# EAGLE schematic ROV_Main_Board (EAGLE 7.5.0)
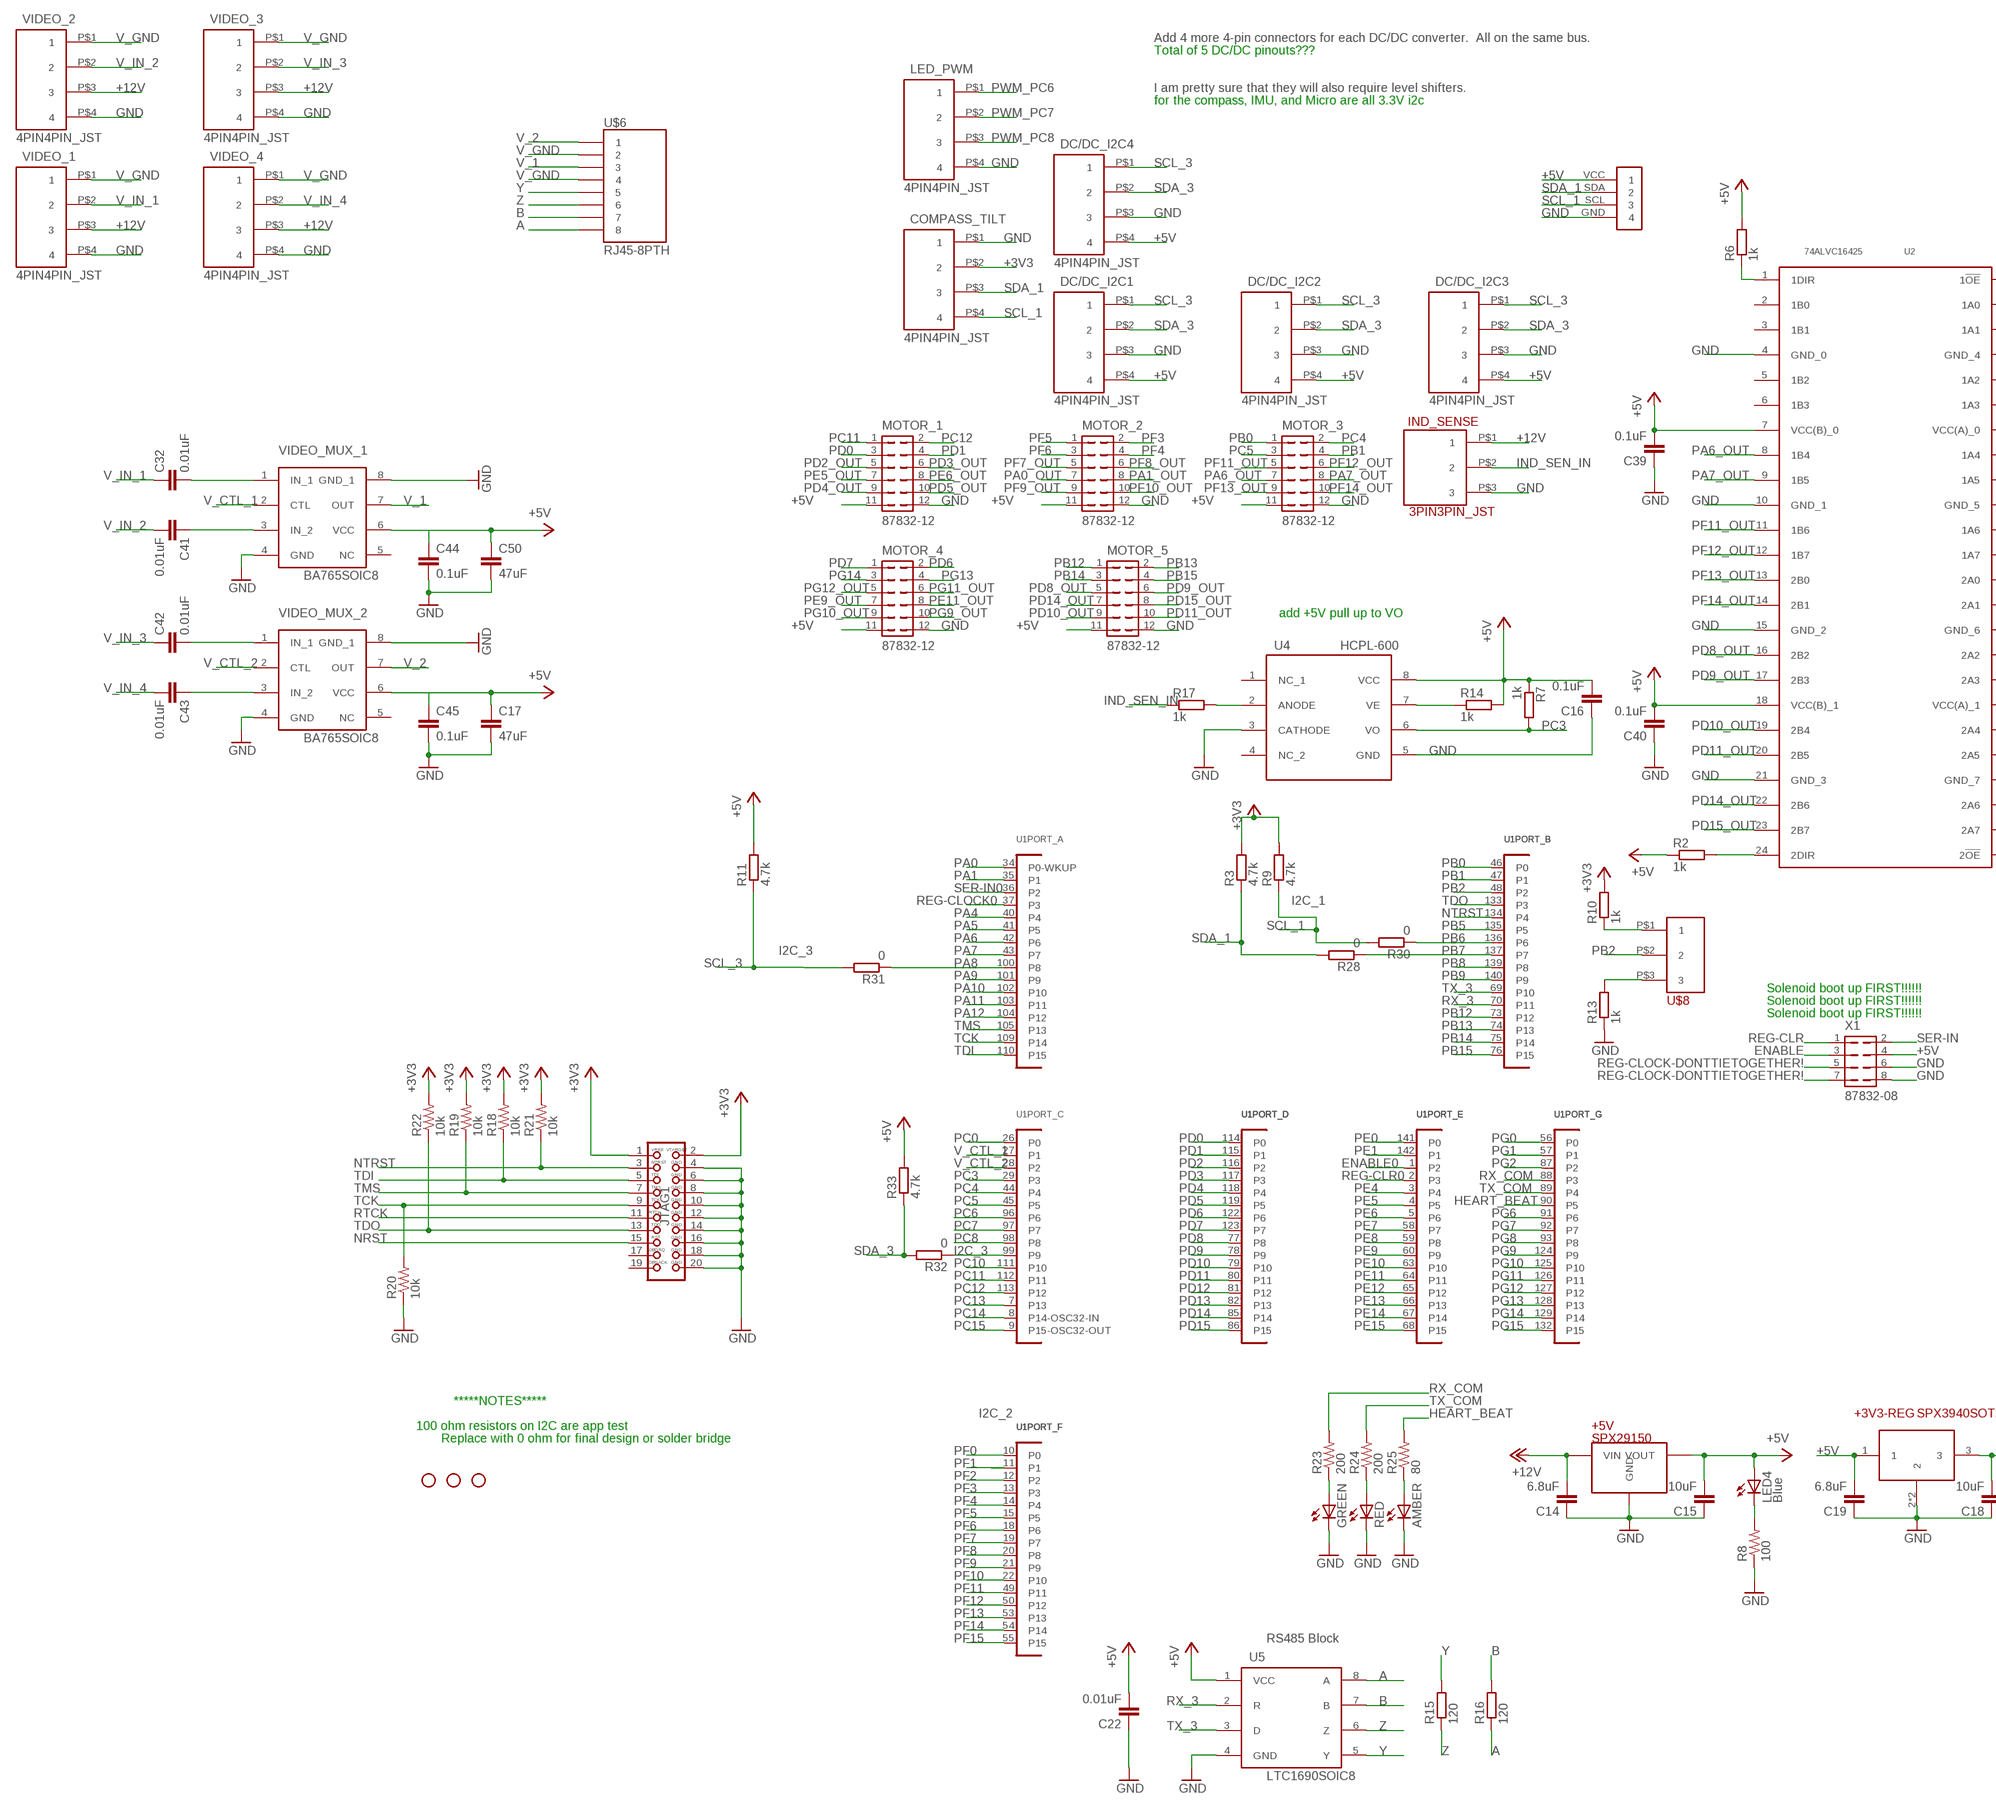
[diagram p0: schematic, sheet 1, part 1 of 2]
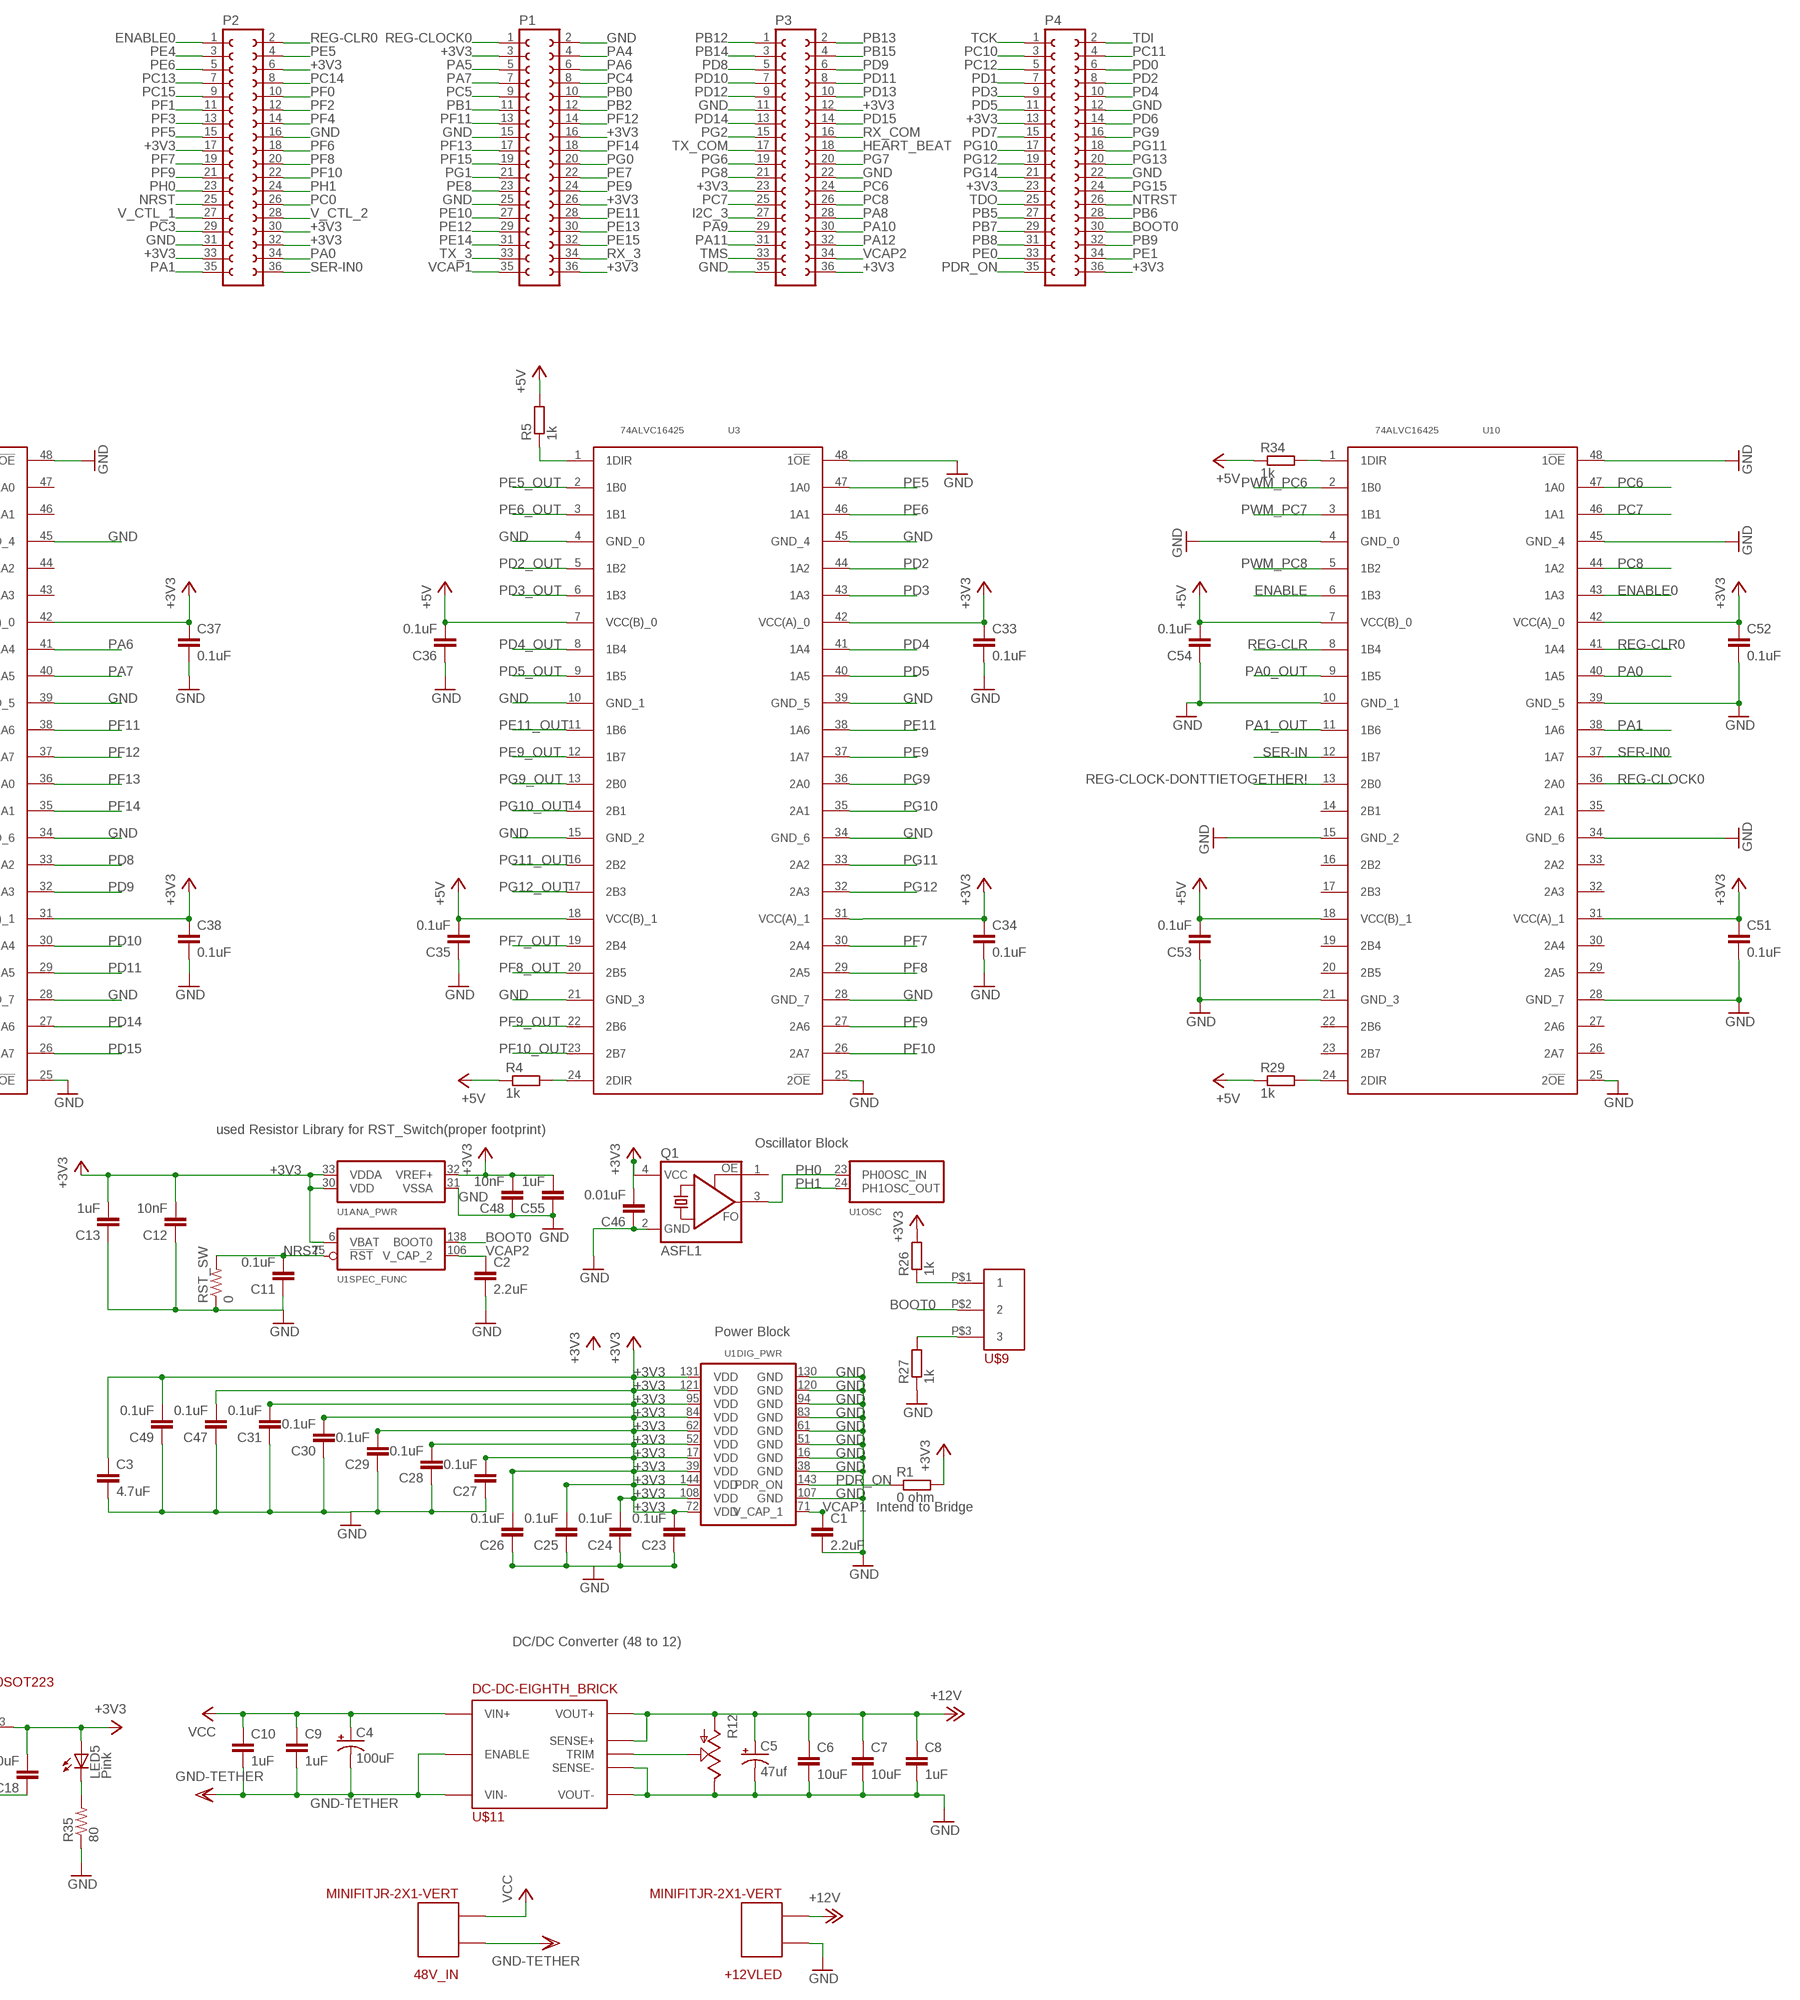
[diagram p1: schematic, sheet 1, part 2 of 2]

## Parts
48V_IN  MINIFITJR-2X1-VERT  [5566-02B]
+3V3-REG  SPX3940SOT223  [SOT223]
+5V  SPX29150  [DDPAK-3PIN]
+12VLED  MINIFITJR-2X1-VERT  [5566-02B]
AMBER  LED0603  [LED-0603]
C1  2.2uF  C-EUC0603  [C0603]
C2  2.2uF  C-EUC0603  [C0603]
C3  4.7uF  C-EUC0603  [C0603]
C4  100uF  CPOL-USE5-10.5  [E5-10,5]
C5  47uf  CPOL-USD  [PANASONIC_D]
C6  10uF  C-EUC0805  [C0805]
C7  10uF  C-EUC0805  [C0805]
C8  1uF  C-EUC0805  [C0805]
C9  1uF  C-EUC0805  [C0805]
C10  1uF  C-EUC0805  [C0805]
C11  0.1uF  C-EUC0603  [C0603]
C12  10nF  C-EUC0603  [C0603]
C13  1uF  C-EUC0603  [C0603]
C14  6.8uF  C-EUC0805  [C0805]
C15  10uF  C-EUC0805  [C0805]
C16  0.1uF  C-EUC0603  [C0603]
C17  47uF  C-EUC1206  [C1206]
C18  10uF  C-EUC0805  [C0805]
C19  6.8uF  C-EUC0805  [C0805]
C22  0.01uF  C-EUC0603  [C0603]
C23  0.1uF  C-EUC0603  [C0603]
C24  0.1uF  C-EUC0603  [C0603]
C25  0.1uF  C-EUC0603  [C0603]
C26  0.1uF  C-EUC0603  [C0603]
C27  0.1uF  C-EUC0603  [C0603]
C28  0.1uF  C-EUC0603  [C0603]
C29  0.1uF  C-EUC0603  [C0603]
C30  0.1uF  C-EUC0603  [C0603]
C31  0.1uF  C-EUC0603  [C0603]
C32  0.01uF  C-EUC0603  [C0603]
C33  0.1uF  C-EUC0603  [C0603]
C34  0.1uF  C-EUC0603  [C0603]
C35  0.1uF  C-EUC0603  [C0603]
C36  0.1uF  C-EUC0603  [C0603]
C37  0.1uF  C-EUC0603  [C0603]
C38  0.1uF  C-EUC0603  [C0603]
C39  0.1uF  C-EUC0603  [C0603]
C40  0.1uF  C-EUC0603  [C0603]
C41  0.01uF  C-EUC0603  [C0603]
C42  0.01uF  C-EUC0603  [C0603]
C43  0.01uF  C-EUC0603  [C0603]
C44  0.1uF  C-EUC0603  [C0603]
C45  0.1uF  C-EUC0603  [C0603]
C46  0.01uF  C-EUC0603  [C0603]
C47  0.1uF  C-EUC0603  [C0603]
C48  10nF  C-EUC0603  [C0603]
C49  0.1uF  C-EUC0603  [C0603]
C50  47uF  C-EUC1206  [C1206]
C51  0.1uF  C-EUC0603  [C0603]
C52  0.1uF  C-EUC0603  [C0603]
C53  0.1uF  C-EUC0603  [C0603]
C54  0.1uF  C-EUC0603  [C0603]
C55  1uF  C-EUC0603  [C0603]
COMPASS_TILT  4PIN4PIN_JST  [4PIN_JST]
DC/DC_I2C1  4PIN4PIN_JST  [4PIN_JST]
DC/DC_I2C2  4PIN4PIN_JST  [4PIN_JST]
DC/DC_I2C3  4PIN4PIN_JST  [4PIN_JST]
DC/DC_I2C4  4PIN4PIN_JST  [4PIN_JST]
GREEN  LED0603  [LED-0603]
IND_SENSE  3PIN3PIN_JST  [3PIN_JST]
JP1  STAND-OFF  [STAND-OFF]
JP2  STAND-OFF  [STAND-OFF]
JP3  STAND-OFF  [STAND-OFF]
JTAG1  JTAG-ARM  [JTAG-ARM]
LED4  Blue  LED0603  [LED-0603]
LED5  Pink  LED0603  [LED-0603]
LED_PWM  4PIN4PIN_JST  [4PIN_JST]
MOTOR_1  87832-12  [87832-12]
MOTOR_2  87832-12  [87832-12]
MOTOR_3  87832-12  [87832-12]
MOTOR_4  87832-12  [87832-12]
MOTOR_5  87832-12  [87832-12]
P1  FE18-2  [FE18-2]
P2  FE18-2  [FE18-2]
P3  FE18-2  [FE18-2]
P4  FE18-2  [FE18-2]
Q1  ASFL1  [ASF]
R1  0 ohm  R-EU_R0603  [R0603]
R2  1k  R-EU_R0603  [R0603]
R3  4.7k  R-EU_R0603  [R0603]
R4  1k  R-EU_R0603  [R0603]
R5  1k  R-EU_R0603  [R0603]
R6  1k  R-EU_R0603  [R0603]
R7  1k  R-EU_R0603  [R0603]
R8  100  RESISTOR0603-RES  [0603-RES]
R9  4.7k  R-EU_R0603  [R0603]
R10  1k  R-EU_R0603  [R0603]
R11  4.7k  R-EU_R0603  [R0603]
R12  TRIM_US-SM-42/43W  [SM-42/43W]
R13  1k  R-EU_R0603  [R0603]
R14  1k  R-EU_R0603  [R0603]
R15  120  R-EU_R0603  [R0603]
R16  120  R-EU_R0603  [R0603]
R17  1k  R-EU_R0603  [R0603]
R18  10k  R-US_R0603  [R0603]
R19  10k  R-US_R0603  [R0603]
R20  10k  R-US_R0603  [R0603]
R21  10k  R-US_R0603  [R0603]
R22  10k  R-US_R0603  [R0603]
R23  200  R-US_R0603  [R0603]
R24  200  R-US_R0603  [R0603]
R25  80  R-US_R0603  [R0603]
R26  1k  R-EU_R0603  [R0603]
R27  1k  R-EU_R0603  [R0603]
R28  0  R-EU_R0603  [R0603]
R29  1k  R-EU_R0603  [R0603]
R30  0  R-EU_R0603  [R0603]
R31  0  R-EU_R0603  [R0603]
R32  0  R-EU_R0603  [R0603]
R33  4.7k  R-EU_R0603  [R0603]
R34  1k  R-EU_R0603  [R0603]
R35  80  RESISTOR0603-RES  [0603-RES]
RED  LED0603  [LED-0603]
RST_SW  0  R-US_R2512  [R2512]
U1  STM32F103ZESTM32F407  [SQFP-S-20X20-144]
U2  74ALVC16425  [TSSOP48]
U3  74ALVC16425  [TSSOP48]
U4  HCPL-600  [SOIC8]
U5  LTC1690SOIC8  [SOIC8]
U10  74ALVC16425  [TSSOP48]
U$6  RJ45-8PTH  [RJ45-8]
U$7  9DOF-IMU-SFE  [9DOF-SFE]
U$8  1X3-SMD-1.27MM  [1X3-1.27-SMD]
U$9  1X3-SMD-1.27MM  [1X3-1.27-SMD]
U$11  DC-DC-EIGHTH_BRICK  [EIGHTH-BRICK]
VIDEO_1  4PIN4PIN_JST  [4PIN_JST]
VIDEO_2  4PIN4PIN_JST  [4PIN_JST]
VIDEO_3  4PIN4PIN_JST  [4PIN_JST]
VIDEO_4  4PIN4PIN_JST  [4PIN_JST]
VIDEO_MUX_1  BA765SOIC8  [SOIC8]
VIDEO_MUX_2  BA765SOIC8  [SOIC8]
X1  87832-08  [87832-08]

## Nets
+3V3: +3V3-REG.3 C3.1 C12.2 C13.2 C18.2 C23.2 C24.2 C25.2 C26.2 C27.2 C28.2 C29.2 C30.2 C31.2 C33.1 C34.1 C37.1 C38.1 C46.2 C47.2 C48.2 C49.2 C51.1 C52.1 C55.2 COMPASS_TILT.P$2 JTAG1.1 JTAG1.2 LED5.A P1.3 P1.16 P1.26 P1.36 P2.6 P2.17 P2.30 P2.32 P2.33 P3.12 P3.23 P3.36 P4.13 P4.23 P4.36 Q1.4(VCC) R1.2 R3.2 R9.2 R10.2 R18.2 R19.2 R21.2 R22.2 R26.2 U1.6(SPEC_FUNC:VBAT) U1.17(DIG_PWR:VDD) U1.30(ANA_PWR:VDD) U1.32(ANA_PWR:VREF+) U1.33(ANA_PWR:VDDA) U1.39(DIG_PWR:VDD) U1.52(DIG_PWR:VDD) U1.62(DIG_PWR:VDD) U1.72(DIG_PWR:VDD) U1.84(DIG_PWR:VDD) U1.95(DIG_PWR:VDD) U1.108(DIG_PWR:VDD) U1.121(DIG_PWR:VDD) U1.131(DIG_PWR:VDD) U1.144(DIG_PWR:VDD) U2.31(VCC(A)_1) U2.42(VCC(A)_0) U3.31(VCC(A)_1) U3.42(VCC(A)_0) U10.31(VCC(A)_1) U10.42(VCC(A)_0)
+5V: +3V3-REG.1 +5V.P$3(VOUT) C15.2 C16.2 C17.1 C19.2 C22.2 C35.2 C36.2 C39.2 C40.2 C44.1 C45.1 C50.1 C53.2 C54.2 DC/DC_I2C1.P$4 DC/DC_I2C2.P$4 DC/DC_I2C3.P$4 DC/DC_I2C4.P$4 LED4.A MOTOR_1.11 MOTOR_2.11 MOTOR_3.11 MOTOR_4.11 MOTOR_5.11 R2.1 R4.1 R5.2 R6.2 R7.1 R11.2 R14.2 R29.1 R33.2 R34.1 U2.7(VCC(B)_0) U2.18(VCC(B)_1) U3.7(VCC(B)_0) U3.18(VCC(B)_1) U4.8(VCC) U5.1(VCC) U10.7(VCC(B)_0) U10.18(VCC(B)_1) U$7.VCC VIDEO_MUX_1.6(VCC) VIDEO_MUX_2.6(VCC) X1.4
+12V: +5V.P$1(VIN) +12VLED.P$2 C5.+ C6.1 C7.1 C8.1 C14.2 IND_SENSE.P$1 R12.1(A) U$11.SENSE(+)(SENSE+) U$11.VOUT(+)(VOUT+) VIDEO_1.P$3 VIDEO_2.P$3 VIDEO_3.P$3 VIDEO_4.P$3
A: R16.1 U5.8(A) U$6.8
B: R16.2 U5.7(B) U$6.7
BOOT0: P4.30 U1.138(SPEC_FUNC:BOOT0) U$9.P$2
ENABLE: U10.6(1B3) X1.3
ENABLE0: P2.1 U1.1(PORT_E:P2) U10.43(1A3)
GND: +3V3-REG.2 +3V3-REG.4 +5V.P$2(GND) +5V.P$4(GND) +12VLED.P$1 AMBER.C C1.2 C2.2 C3.2 C5.- C6.2 C7.2 C8.2 C11.1 C12.1 C13.1 C14.1 C15.1 C16.1 C17.2 C18.1 C19.1 C22.1 C23.1 C24.1 C25.1 C26.1 C27.1 C28.1 C29.1 C30.1 C31.1 C33.2 C34.2 C35.1 C36.1 C37.2 C38.2 C39.1 C40.1 C44.2 C45.2 C46.1 C47.1 C48.1 C49.1 C50.2 C51.2 C52.2 C53.1 C54.1 C55.1 COMPASS_TILT.P$1 DC/DC_I2C1.P$3 DC/DC_I2C2.P$3 DC/DC_I2C3.P$3 DC/DC_I2C4.P$3 GREEN.C IND_SENSE.P$3 JTAG1.4 JTAG1.6 JTAG1.8 JTAG1.10 JTAG1.12 JTAG1.14 JTAG1.16 JTAG1.18 JTAG1.20 LED_PWM.P$4 MOTOR_1.12 MOTOR_2.12 MOTOR_3.12 MOTOR_4.12 MOTOR_5.12 P1.2 P1.15 P1.25 P2.16 P2.31 P3.11 P3.22 P3.35 P4.12 P4.22 Q1.2(GND) R8.1 R12.3(E) R13.1 R20.1 R27.1 R35.1 RED.C RST_SW.1 U1.16(DIG_PWR:GND) U1.31(ANA_PWR:VSSA) U1.38(DIG_PWR:GND) U1.51(DIG_PWR:GND) U1.61(DIG_PWR:GND) U1.83(DIG_PWR:GND) U1.94(DIG_PWR:GND) U1.107(DIG_PWR:GND) U1.120(DIG_PWR:GND) U1.130(DIG_PWR:GND) U2.4(GND_0) U2.10(GND_1) U2.15(GND_2) U2.21(GND_3) U2.25(2!OE) U2.28(GND_7) U2.34(GND_6) U2.39(GND_5) U2.45(GND_4) U2.48(1!OE) U3.4(GND_0) U3.10(GND_1) U3.15(GND_2) U3.21(GND_3) U3.25(2!OE) U3.28(GND_7) U3.34(GND_6) U3.39(GND_5) U3.45(GND_4) U3.48(1!OE) U4.3(CATHODE) U4.5(GND) U5.4(GND) U10.4(GND_0) U10.10(GND_1) U10.15(GND_2) U10.21(GND_3) U10.25(2!OE) U10.28(GND_7) U10.34(GND_6) U10.39(GND_5) U10.45(GND_4) U10.48(1!OE) U$7.GND U$11.SENSE(-)(SENSE-) U$11.VOUT(-)(VOUT-) VIDEO_1.P$4 VIDEO_2.P$4 VIDEO_3.P$4 VIDEO_4.P$4 VIDEO_MUX_1.4(GND) VIDEO_MUX_1.8(GND_1) VIDEO_MUX_2.4(GND) VIDEO_MUX_2.8(GND_1) X1.6 X1.8
GND-TETHER: 48V_IN.P$1 C4.- C9.2 C10.2 U$11.ENABLE U$11.VIN(-)(VIN-)
HEART_BEAT: P3.18 R25.2 U1.90(PORT_G:P5)
I2C_3: P3.27 R32.1 U1.99(PORT_C:P9)
IND_SEN_IN: IND_SENSE.P$2 R17.1
N$1: R12.2(S) U$11.TRIM
N$2: LED4.C R8.2
N$3: R26.1 U$9.P$1
N$4: LED5.C R35.2
N$8: R14.1 U4.7(VE)
N$10: R17.2 U4.2(ANODE)
N$12: GREEN.A R23.1
N$13: R24.1 RED.A
N$14: C32.2 VIDEO_MUX_1.1(IN_1)
N$15: AMBER.A R25.1
N$19: C41.1 VIDEO_MUX_1.3(IN_2)
N$20: C42.2 VIDEO_MUX_2.1(IN_1)
N$21: C43.1 VIDEO_MUX_2.3(IN_2)
N$24: R29.2 U10.24(2DIR)
N$25: R27.2 U$9.P$3
N$26: R6.1 U2.1(1DIR)
N$27: R5.1 U3.1(1DIR)
N$28: R4.2 U3.24(2DIR)
N$29: R2.2 U2.24(2DIR)
N$30: R10.1 U$8.P$1
N$31: R13.2 U$8.P$3
N$32: R34.2 U10.1(1DIR)
NRST: C11.2 JTAG1.15 P2.25 RST_SW.2 U1.25(SPEC_FUNC:!RST)
NTRST: JTAG1.3 P4.26 R21.1 U1.134(PORT_B:P4)
PA0: P2.34 U1.34(PORT_A:P0-WKUP) U10.40(1A5)
PA0_OUT: MOTOR_2.7 U10.9(1B5)
PA1: P2.35 U1.35(PORT_A:P1) U10.38(1A6)
PA1_OUT: MOTOR_2.8 U10.11(1B6)
PA4: P1.4 U1.40(PORT_A:P4)
PA5: P1.5 U1.41(PORT_A:P5)
PA6: P1.6 U1.42(PORT_A:P6) U2.41(1A4)
PA6_OUT: MOTOR_3.7 U2.8(1B4)
PA7: P1.7 U1.43(PORT_A:P7) U2.40(1A5)
PA7_OUT: MOTOR_3.8 U2.9(1B5)
PA8: P3.28 R31.1 U1.100(PORT_A:P8)
PA9: P3.29 U1.101(PORT_A:P9)
PA10: P3.30 U1.102(PORT_A:P10)
PA11: P3.31 U1.103(PORT_A:P11)
PA12: P3.32 U1.104(PORT_A:P12)
PB0: MOTOR_3.1 P1.10 U1.46(PORT_B:P0)
PB1: MOTOR_3.4 P1.11 U1.47(PORT_B:P1)
PB2: P1.12 U1.48(PORT_B:P2) U$8.P$2
PB5: P4.27 U1.135(PORT_B:P5)
PB6: P4.28 R30.1 U1.136(PORT_B:P6)
PB7: P4.29 R28.1 U1.137(PORT_B:P7)
PB8: P4.31 U1.139(PORT_B:P8)
PB9: P4.32 U1.140(PORT_B:P9)
PB12: MOTOR_5.1 P3.1 U1.73(PORT_B:P12)
PB13: MOTOR_5.2 P3.2 U1.74(PORT_B:P13)
PB14: MOTOR_5.3 P3.3 U1.75(PORT_B:P14)
PB15: MOTOR_5.4 P3.4 U1.76(PORT_B:P15)
PC0: P2.26 U1.26(PORT_C:P0)
PC3: P2.29 R7.2 U1.29(PORT_C:P3) U4.6(VO)
PC4: MOTOR_3.2 P1.8 U1.44(PORT_C:P4)
PC5: MOTOR_3.3 P1.9 U1.45(PORT_C:P5)
PC6: P3.24 U1.96(PORT_C:P6) U10.47(1A0)
PC7: P3.25 U1.97(PORT_C:P7) U10.46(1A1)
PC8: P3.26 U1.98(PORT_C:P8) U10.44(1A2)
PC10: P4.3 U1.111(PORT_C:P10)
PC11: MOTOR_1.1 P4.4 U1.112(PORT_C:P11)
PC12: MOTOR_1.2 P4.5 U1.113(PORT_C:P12)
PC13: P2.7 U1.7(PORT_C:P13)
PC14: P2.8 U1.8(PORT_C:P14-OSC32-IN)
PC15: P2.9 U1.9(PORT_C:P15-OSC32-OUT)
PD0: MOTOR_1.3 P4.6 U1.114(PORT_D:P0)
PD1: MOTOR_1.4 P4.7 U1.115(PORT_D:P1)
PD2: P4.8 U1.116(PORT_D:P2) U3.44(1A2)
PD2_OUT: MOTOR_1.5 U3.5(1B2)
PD3: P4.9 U1.117(PORT_D:P3) U3.43(1A3)
PD3_OUT: MOTOR_1.6 U3.6(1B3)
PD4: P4.10 U1.118(PORT_D:P4) U3.41(1A4)
PD4_OUT: MOTOR_1.9 U3.8(1B4)
PD5: P4.11 U1.119(PORT_D:P5) U3.40(1A5)
PD5_OUT: MOTOR_1.10 U3.9(1B5)
PD6: MOTOR_4.2 P4.14 U1.122(PORT_D:P6)
PD7: MOTOR_4.1 P4.15 U1.123(PORT_D:P7)
PD8: P3.5 U1.77(PORT_D:P8) U2.33(2A2)
PD8_OUT: MOTOR_5.5 U2.16(2B2)
PD9: P3.6 U1.78(PORT_D:P9) U2.32(2A3)
PD9_OUT: MOTOR_5.6 U2.17(2B3)
PD10: P3.7 U1.79(PORT_D:P10) U2.30(2A4)
PD10_OUT: MOTOR_5.9 U2.19(2B4)
PD11: P3.8 U1.80(PORT_D:P11) U2.29(2A5)
PD11_OUT: MOTOR_5.10 U2.20(2B5)
PD12: P3.9 U1.81(PORT_D:P12)
PD13: P3.10 U1.82(PORT_D:P13)
PD14: P3.13 U1.85(PORT_D:P14) U2.27(2A6)
PD14_OUT: MOTOR_5.7 U2.22(2B6)
PD15: P3.14 U1.86(PORT_D:P15) U2.26(2A7)
PD15_OUT: MOTOR_5.8 U2.23(2B7)
PDR_ON: P4.35 R1.1 U1.143(DIG_PWR:PDR_ON)
PE0: P4.33 U1.141(PORT_E:P0)
PE1: P4.34 U1.142(PORT_E:P1)
PE4: P2.3 U1.3(PORT_E:P4)
PE5: P2.4 U1.4(PORT_E:P5) U3.47(1A0)
PE5_OUT: MOTOR_1.7 U3.2(1B0)
PE6: P2.5 U1.5(PORT_E:P6) U3.46(1A1)
PE6_OUT: MOTOR_1.8 U3.3(1B1)
PE7: P1.22 U1.58(PORT_E:P7)
PE8: P1.23 U1.59(PORT_E:P8)
PE9: P1.24 U1.60(PORT_E:P9) U3.37(1A7)
PE9_OUT: MOTOR_4.7 U3.12(1B7)
PE10: P1.27 U1.63(PORT_E:P10)
PE11: P1.28 U1.64(PORT_E:P11) U3.38(1A6)
PE11_OUT: MOTOR_4.8 U3.11(1B6)
PE12: P1.29 U1.65(PORT_E:P12)
PE13: P1.30 U1.66(PORT_E:P13)
PE14: P1.31 U1.67(PORT_E:P14)
PE15: P1.32 U1.68(PORT_E:P15)
PF0: P2.10 U1.10(PORT_F:P0)
PF1: P2.11 U1.11(PORT_F:P1)
PF2: P2.12 U1.12(PORT_F:P2)
PF3: MOTOR_2.2 P2.13 U1.13(PORT_F:P3)
PF4: MOTOR_2.4 P2.14 U1.14(PORT_F:P4)
PF5: MOTOR_2.1 P2.15 U1.15(PORT_F:P5)
PF6: MOTOR_2.3 P2.18 U1.18(PORT_F:P6)
PF7: P2.19 U1.19(PORT_F:P7) U3.30(2A4)
PF7_OUT: MOTOR_2.5 U3.19(2B4)
PF8: P2.20 U1.20(PORT_F:P8) U3.29(2A5)
PF8_OUT: MOTOR_2.6 U3.20(2B5)
PF9: P2.21 U1.21(PORT_F:P9) U3.27(2A6)
PF9_OUT: MOTOR_2.9 U3.22(2B6)
PF10: P2.22 U1.22(PORT_F:P10) U3.26(2A7)
PF10_OUT: MOTOR_2.10 U3.23(2B7)
PF11: P1.13 U1.49(PORT_F:P11) U2.38(1A6)
PF11_OUT: MOTOR_3.5 U2.11(1B6)
PF12: P1.14 U1.50(PORT_F:P12) U2.37(1A7)
PF12_OUT: MOTOR_3.6 U2.12(1B7)
PF13: P1.17 U1.53(PORT_F:P13) U2.36(2A0)
PF13_OUT: MOTOR_3.9 U2.13(2B0)
PF14: P1.18 U1.54(PORT_F:P14) U2.35(2A1)
PF14_OUT: MOTOR_3.10 U2.14(2B1)
PF15: P1.19 U1.55(PORT_F:P15)
PG0: P1.20 U1.56(PORT_G:P0)
PG1: P1.21 U1.57(PORT_G:P1)
PG2: P3.15 U1.87(PORT_G:P2)
PG6: P3.19 U1.91(PORT_G:P6)
PG7: P3.20 U1.92(PORT_G:P7)
PG8: P3.21 U1.93(PORT_G:P8)
PG9: P4.16 U1.124(PORT_G:P9) U3.36(2A0)
PG9_OUT: MOTOR_4.10 U3.13(2B0)
PG10: P4.17 U1.125(PORT_G:P10) U3.35(2A1)
PG10_OUT: MOTOR_4.9 U3.14(2B1)
PG11: P4.18 U1.126(PORT_G:P11) U3.33(2A2)
PG11_OUT: MOTOR_4.6 U3.16(2B2)
PG12: P4.19 U1.127(PORT_G:P12) U3.32(2A3)
PG12_OUT: MOTOR_4.5 U3.17(2B3)
PG13: MOTOR_4.4 P4.20 U1.128(PORT_G:P13)
PG14: MOTOR_4.3 P4.21 U1.129(PORT_G:P14)
PG15: P4.24 U1.132(PORT_G:P15)
PH0: P2.23 Q1.3(FO) U1.23(OSC:PH0OSC_IN)
PH1: P2.24 U1.24(OSC:PH1OSC_OUT)
PWM_PC6: LED_PWM.P$1 U10.2(1B0)
PWM_PC7: LED_PWM.P$2 U10.3(1B1)
PWM_PC8: LED_PWM.P$3 U10.5(1B2)
REG-CLOCK0: P1.1 U1.37(PORT_A:P3) U10.36(2A0)
REG-CLOCK-DONTTIETOGETHER!: U10.13(2B0) X1.5 X1.7
REG-CLR: U10.8(1B4) X1.1
REG-CLR0: P2.2 U1.2(PORT_E:P3) U10.41(1A4)
RTCK: JTAG1.11
RX_3: P1.34 U1.70(PORT_B:P11) U5.2(R)
RX_COM: P3.16 R23.2 U1.88(PORT_G:P3)
SCL_1: COMPASS_TILT.P$4 R9.1 R30.2 U$7.SCL
SCL_3: DC/DC_I2C1.P$1 DC/DC_I2C2.P$1 DC/DC_I2C3.P$1 DC/DC_I2C4.P$1 R11.1 R31.2
SDA_1: COMPASS_TILT.P$3 R3.1 R28.2 U$7.SDA
SDA_3: DC/DC_I2C1.P$2 DC/DC_I2C2.P$2 DC/DC_I2C3.P$2 DC/DC_I2C4.P$2 R32.2 R33.1
SER-IN: U10.12(1B7) X1.2
SER-IN0: P2.36 U1.36(PORT_A:P2) U10.37(1A7)
TCK: JTAG1.9 P4.1 R20.2 U1.109(PORT_A:P14)
TDI: JTAG1.5 P4.2 R18.1 U1.110(PORT_A:P15)
TDO: JTAG1.13 P4.25 R22.1 U1.133(PORT_B:P3)
TMS: JTAG1.7 P3.33 R19.1 U1.105(PORT_A:P13)
TX_3: P1.33 U1.69(PORT_B:P10) U5.3(D)
TX_COM: P3.17 R24.2 U1.89(PORT_G:P4)
V_1: U$6.3 VIDEO_MUX_1.7(OUT)
V_2: U$6.1 VIDEO_MUX_2.7(OUT)
V_CTL_1: P2.27 U1.27(PORT_C:P1) VIDEO_MUX_1.2(CTL)
V_CTL_2: P2.28 U1.28(PORT_C:P2) VIDEO_MUX_2.2(CTL)
V_GND: U$6.2 U$6.4 VIDEO_1.P$1 VIDEO_2.P$1 VIDEO_3.P$1 VIDEO_4.P$1
V_IN_1: C32.1 VIDEO_1.P$2
V_IN_2: C41.2 VIDEO_2.P$2
V_IN_3: C42.1 VIDEO_3.P$2
V_IN_4: C43.2 VIDEO_4.P$2
VCAP1: C1.1 P1.35 U1.71(DIG_PWR:V_CAP_1)
VCAP2: C2.1 P3.34 U1.106(SPEC_FUNC:V_CAP_2)
VCC: 48V_IN.P$2 C4.+ C9.1 C10.1 U$11.VIN(+)(VIN+)
Y: R15.2 U5.5(Y) U$6.5
Z: R15.1 U5.6(Z) U$6.6
Unconnected: JTAG1.17 JTAG1.19 Q1.1(OE) U2.2(1B0) U2.3(1B1) U2.5(1B2) U2.6(1B3) U2.43(1A3) U2.44(1A2) U2.46(1A1) U2.47(1A0) U4.1(NC_1) U4.4(NC_2) U10.14(2B1) U10.16(2B2) U10.17(2B3) U10.19(2B4) U10.20(2B5) U10.22(2B6) U10.23(2B7) U10.26(2A7) U10.27(2A6) U10.29(2A5) U10.30(2A4) U10.32(2A3) U10.33(2A2) U10.35(2A1) VIDEO_MUX_1.5(NC) VIDEO_MUX_2.5(NC)

## Notes on the sheet
- Add 4 more 4-pin connectors for each DC/DC converter.  All on the same bus.
- Total of 5 DC/DC pinouts???
- I am pretty sure that they will also require level shifters.
- for the compass, IMU, and Micro are all 3.3V i2c
- add +5V pull up to VO
- I2C_1 | used Resistor Library for RST_Switch(proper footprint)
- Oscillator Block
- I2C_3
- Solenoid boot up FIRST!!!!!!
- Solenoid boot up FIRST!!!!!!
- Solenoid boot up FIRST!!!!!!
- Power Block
- Intend to Bridge
- DC/DC Converter (48 to 12)
- *****NOTES*****
- I2C_2
- 100 ohm resistors on I2C are app test
- Replace with 0 ohm for final design or solder bridge
- RS485 Block

## Library data of the parts
48V_IN +12VLED = Personal:MINIFITJR-2X1-VERT
+3V3-REG = spx3940:SPX3940
+5V = Personal:SPX29150
AMBER GREEN RED = SparkFun:LED: LEDs Standard schematic elements and footprints for 5mm, 3mm, 1206, and 0603 sized LEDs. 5mm - Spark Fun Electronics SKU : COM-00529 (and others)
C1 C2 = resistor:C-EU: CAPACITOR, European symbol; BOM: INCLUDE; PARTNO: 587-1263-1-ND
C3 = resistor:C-EU: CAPACITOR, European symbol; BOM: INCLUDE; PARTNO: 587-2786-1-ND
C4 = resistor:CPOL-US: POLARIZED CAPACITOR, American symbol; BOM: INCLUDE; PARTNO: 493-1668-ND
C5 = resistor:CPOL-US: POLARIZED CAPACITOR, American symbol; BOM: INCLUDE; PARTNO: PCE3929CT-ND
C6 C7 C15 C18 = resistor:C-EU: CAPACITOR, European symbol; BOM: INCLUDE; PARTNO: 587-2985-1-ND
C8-C10 C13 C55 = resistor:C-EU: CAPACITOR, European symbol; BOM: INCLUDE; PARTNO: 445-5205-1-ND
C11 C16 C23-C31 C33-C40 C44 C45 C47 C49 C51-C54 = resistor:C-EU: CAPACITOR, European symbol; BOM: INCLUDE; PARTNO: 311-1344-1-ND
C12 C22 C32 C41-C43 C46 C48 = resistor:C-EU: CAPACITOR, European symbol; BOM: INCLUDE; PARTNO: 478-1227-1-ND
C14 C19 = resistor:C-EU: CAPACITOR, European symbol; BOM: INCLUDE; PARTNO: 445-5982-1-ND
C17 C50 = resistor:C-EU: CAPACITOR, European symbol; BOM: INCLUDE; PARTNO: 490-5528-1-ND
COMPASS_TILT DC/DC_I2C1-DC/DC_I2C4 LED_PWM = 4pin:4PIN; BOM: INCLUDE; PARTNO: 455-1659-ND
IND_SENSE = 3pin:3PIN; BOM: INCLUDE; PARTNO: 455-1658-ND
JP1-JP3 = SparkFun:STAND-OFF: Stand Off This is the mechanical footprint for a #4 phillips button head screw. Use the keepout ring to avoid running the screw head into surrounding components. SKU : PRT-00447
JTAG1 = microbuilder:JTAG-ARM: 20 Pin JTAG Connector For use with ARM7, and ARM9. Supported by some Cortex M3 boards with SWJ-DP interfaces (dual SWP/JTAG support). 4UConnector: 03556; BOM: INCLUDE; PARTNO: S9172-ND
LED4 LED5 = SparkFun-LED:LED: LEDs Standard schematic elements and footprints for 5mm, 3mm, 1206, and 0603 sized LEDs. 5mm - Spark Fun Electronics SKU : COM-00529 (and others)
MOTOR_1-MOTOR_5 = con-molex:87832-12: Milli-Grid Header 2.00mm (.079") Pitch; BOM: INCLUDE; OC_FARNELL: 1756948; OC_NEWARK: unknown; PARTNO: WM18640-ND
P1-P4 = Personal:FE18-2: FEMALE HEADER; OC_FARNELL: unknown; OC_NEWARK: unknown
Q1 = crystal:ASF*: CRYSTAL CLOCK OSCILLATORS 5.0 Vdc or 3.3 Vdc - LOW PROFILE ULTRA MINIATURE CERAMIC SURFACE MOUNT Source: http://www.abracon.com/Oscillators/asf1-L-L1.pdf; MF: Abracon Corporation; MPN: ASFL1-125.000MHZ-EC-T; OC_FARNELL: 1838931; OC_NEWARK: 19M1882
R1-R7 R9-R11 R13-R17 R26-R34 = resistor:R-EU_: RESISTOR, European symbol
R8 R35 = SparkFun-Passives:RESISTOR: Resistor Basic schematic elements and footprints for 0603, 1206, and PTH resistors.
R12 = pot:TRIM_US-: POTENTIOMETER
R18-R25 RST_SW = resistor:R-US_: RESISTOR, American symbol
U1 = stm32_lqfp144:STM32F103ZE: 72 MHz, 64KB RAM, 512 KB Flash
U2 U3 U10 = 74alvc164245:74ALVC16425: Bidirectional level shifter/translator
U4 = hcpl-0600:HCPL-600
U5 = ltc1690:LTC1690: RS485 transciever
U$6 = SparkFun-Connectors:RJ45-8: RJ45 Jack Simple RJ45, 8-pin connection - connector for common Cat5, Cat5e, and Cat6 Ethernet cables. Footprint not yet proven in production. Connector sku is PRT-00643; Breakout PCB sku is BOB-00716.
U$7 = Personal:9DOF-IMU-SFE
U$8 U$9 = Personal:1X3-SMD-1.27MM
U$11 = Personal:DC-DC-EIGHTH_BRICK
VIDEO_1-VIDEO_4 = 4pin:4PIN
VIDEO_MUX_1 VIDEO_MUX_2 = ba765:BA765
X1 = con-molex:87832-08: Milli-Grid Header 2.00mm (.079") Pitch; OC_FARNELL: unknown; OC_NEWARK: unknown